# Altium schematic sheet MotorDriver.SchDoc
size A3; SheetNumber: 3; SheetTotal: 4
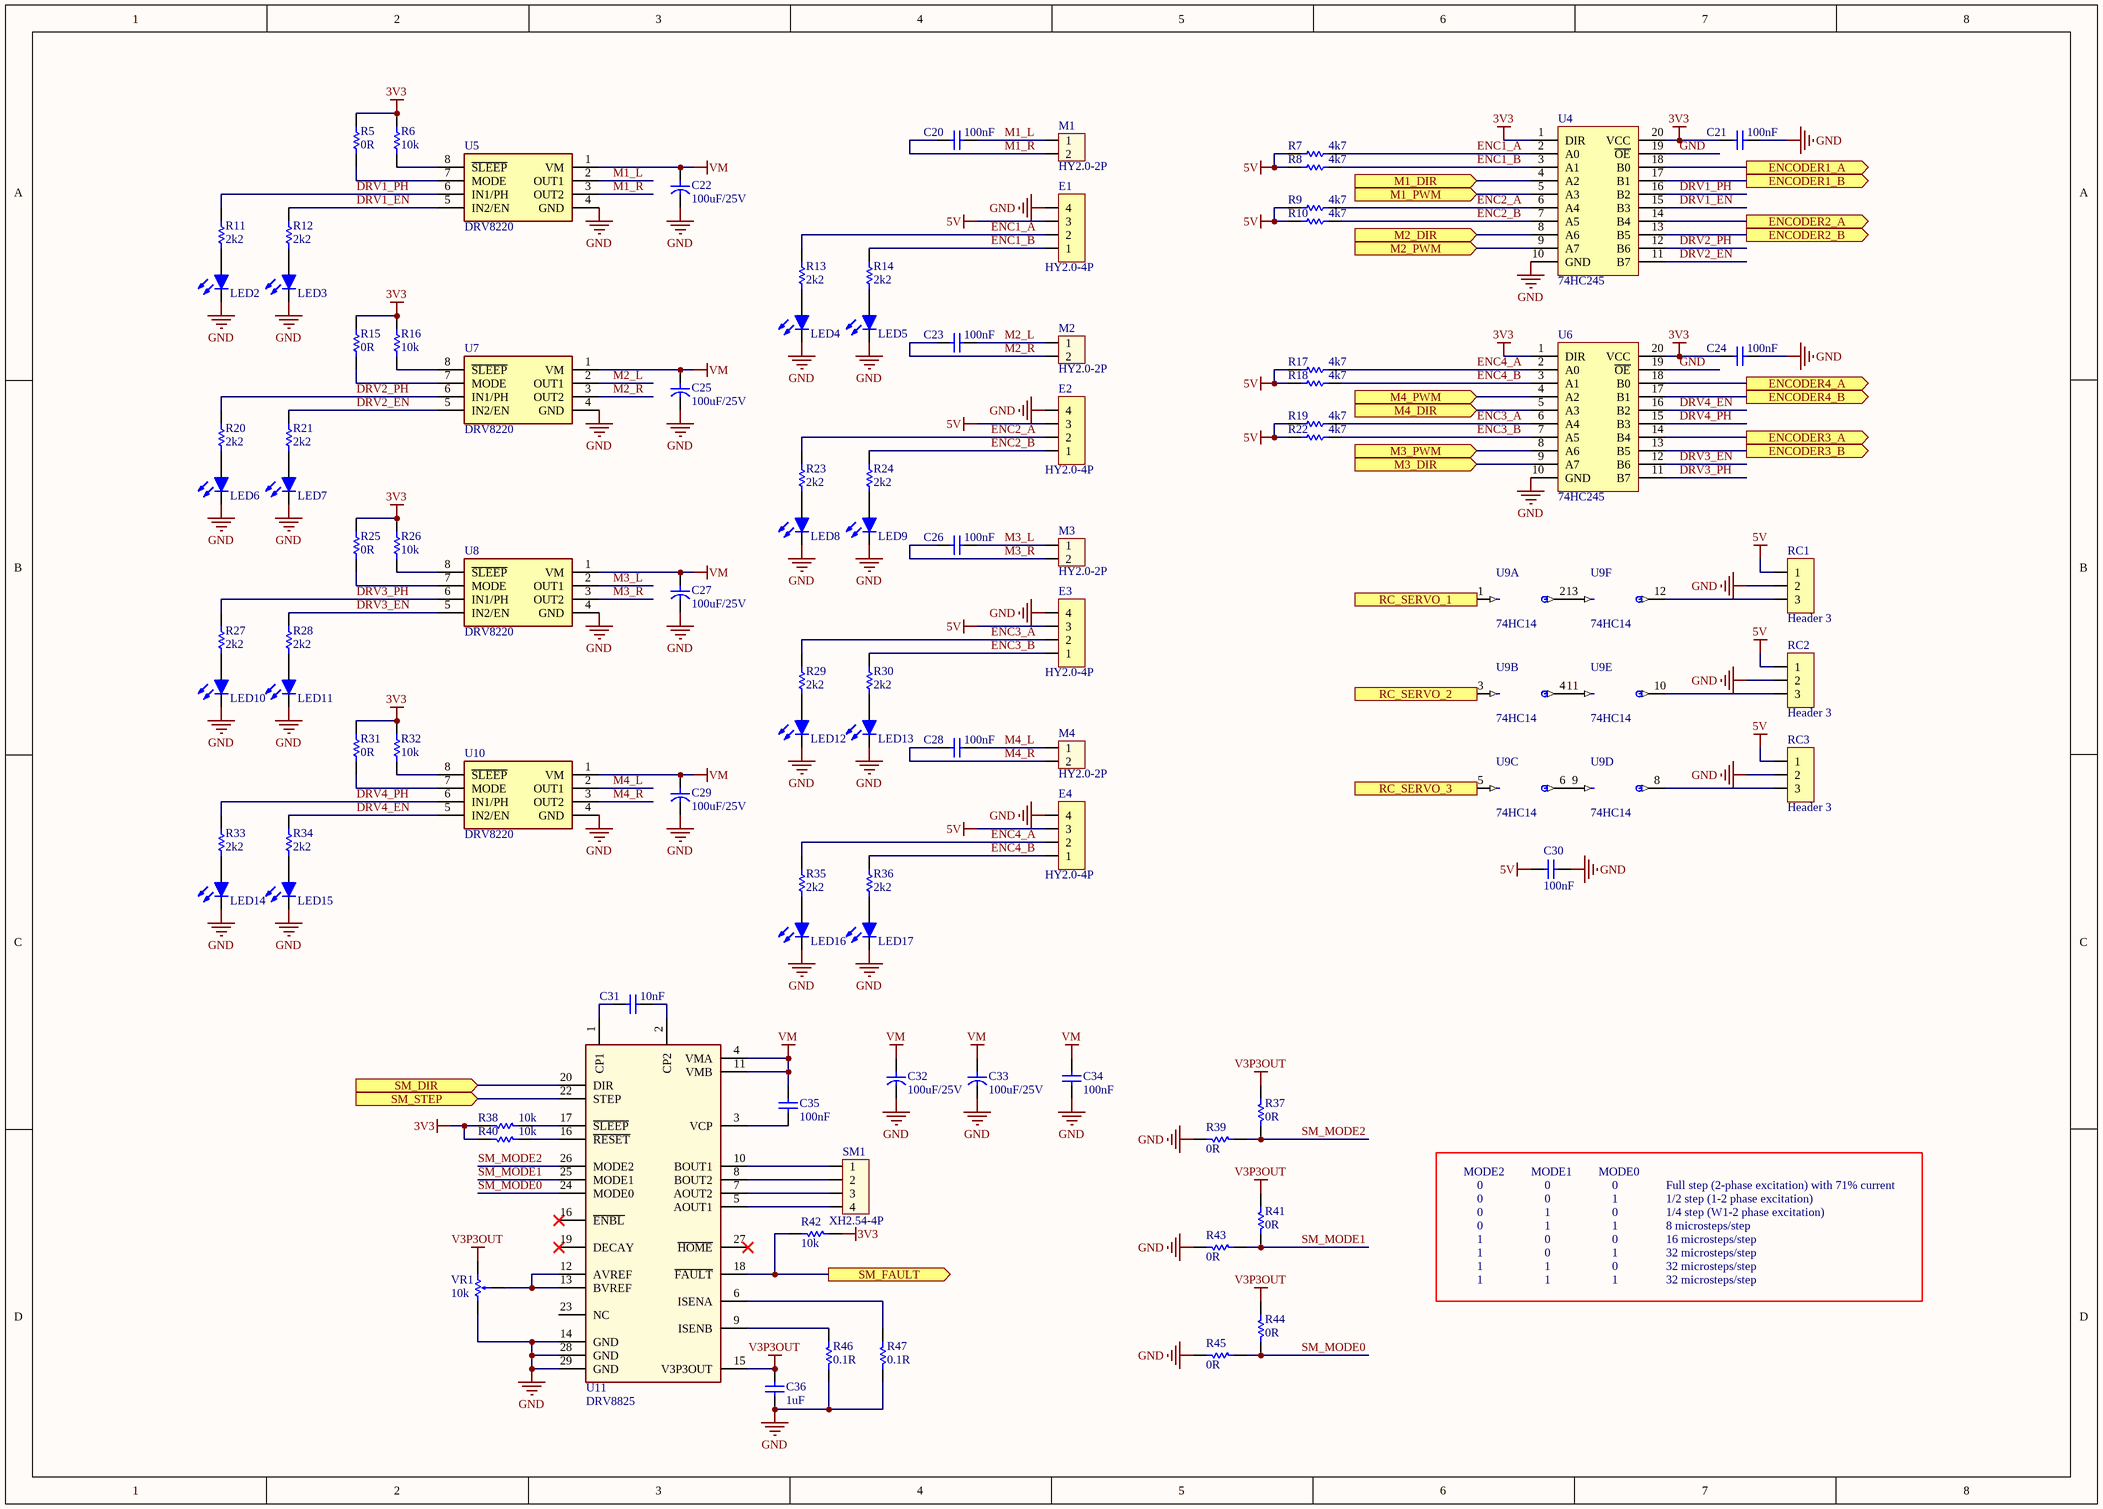
[diagram p0: MotorDriver.SchDoc]

## Parts
C20  100nF  [C 0603 (1608)]
C21  100nF  [C 0603 (1608)]
C22  100uF/25V  [C SMD ALU (D8)]
C23  100nF  [C 0603 (1608)]
C24  100nF  [C 0603 (1608)]
C25  100uF/25V  [C SMD ALU (D8)]
C26  100nF  [C 0603 (1608)]
C27  100uF/25V  [C SMD ALU (D8)]
C28  100nF  [C 0603 (1608)]
C29  100uF/25V  [C SMD ALU (D8)]
C30  100nF  [C 0603 (1608)]
C31  10nF  [C 0603 (1608)]
C32  100uF/25V  [C SMD ALU (D8)]
C33  100uF/25V  [C SMD ALU (D8)]
C34  100nF  [C 0603 (1608)]
C35  100nF  [C 0603 (1608)]
C36  1uF  [C 0603 (1608)]
E1  HY2.0-4P  [HY2.0-4P-RA]
E2  HY2.0-4P  [HY2.0-4P-RA]
E3  HY2.0-4P  [HY2.0-4P-RA]
E4  HY2.0-4P  [HY2.0-4P-RA]
LED2  Led-Red  [Led SMD 0603]  (value not drawn)
LED3  Led-Red  [Led SMD 0603]  (value not drawn)
LED4  Led-Red  [Led SMD 0603]  (value not drawn)
LED5  Led-Red  [Led SMD 0603]  (value not drawn)
LED6  Led-Red  [Led SMD 0603]  (value not drawn)
LED7  Led-Red  [Led SMD 0603]  (value not drawn)
LED8  Led-Red  [Led SMD 0603]  (value not drawn)
LED9  Led-Red  [Led SMD 0603]  (value not drawn)
LED10  Led-Red  [Led SMD 0603]  (value not drawn)
LED11  Led-Red  [Led SMD 0603]  (value not drawn)
LED12  Led-Red  [Led SMD 0603]  (value not drawn)
LED13  Led-Red  [Led SMD 0603]  (value not drawn)
LED14  Led-Red  [Led SMD 0603]  (value not drawn)
LED15  Led-Red  [Led SMD 0603]  (value not drawn)
LED16  Led-Red  [Led SMD 0603]  (value not drawn)
LED17  Led-Red  [Led SMD 0603]  (value not drawn)
M1  HY2.0-2P  [HY2.0-2P-RA]
M2  HY2.0-2P  [HY2.0-2P-RA]
M3  HY2.0-2P  [HY2.0-2P-RA]
M4  HY2.0-2P  [HY2.0-2P-RA]
R5  0R  [R 0603 (1608)]
R6  10k  [R 0603 (1608)]
R7  4k7  [R 0603 (1608)]
R8  4k7  [R 0603 (1608)]
R9  4k7  [R 0603 (1608)]
R10  4k7  [R 0603 (1608)]
R11  2k2  [R 0603 (1608)]
R12  2k2  [R 0603 (1608)]
R13  2k2  [R 0603 (1608)]
R14  2k2  [R 0603 (1608)]
R15  0R  [R 0603 (1608)]
R16  10k  [R 0603 (1608)]
R17  4k7  [R 0603 (1608)]
R18  4k7  [R 0603 (1608)]
R19  4k7  [R 0603 (1608)]
R20  2k2  [R 0603 (1608)]
R21  2k2  [R 0603 (1608)]
R22  4k7  [R 0603 (1608)]
R23  2k2  [R 0603 (1608)]
R24  2k2  [R 0603 (1608)]
R25  0R  [R 0603 (1608)]
R26  10k  [R 0603 (1608)]
R27  2k2  [R 0603 (1608)]
R28  2k2  [R 0603 (1608)]
R29  2k2  [R 0603 (1608)]
R30  2k2  [R 0603 (1608)]
R31  0R  [R 0603 (1608)]
R32  10k  [R 0603 (1608)]
R33  2k2  [R 0603 (1608)]
R34  2k2  [R 0603 (1608)]
R35  2k2  [R 0603 (1608)]
R36  2k2  [R 0603 (1608)]
R37  0R  [R 0603 (1608)]
R38  10k  [R 0603 (1608)]
R39  0R  [R 0603 (1608)]
R40  10k  [R 0603 (1608)]
R41  0R  [R 0603 (1608)]
R42  10k  [R 0603 (1608)]
R43  0R  [R 0603 (1608)]
R44  0R  [R 0603 (1608)]
R45  0R  [R 0603 (1608)]
R46  0.1R  [R 1206 (3216)]
R47  0.1R  [R 1206 (3216)]
RC1  Header 3  [Header 3 - RA]
RC2  Header 3  [Header 3 - RA]
RC3  Header 3  [Header 3 - RA]
SM1  XH2.54-4P  [CON Header 4 - RA]
U4  74HC245  [TSSOP 20 65P]
U5  DRV8220  [WSON 2X2X0.5MM]
U6  74HC245  [TSSOP 20 65P]
U7  DRV8220  [WSON 2X2X0.5MM]
U8  DRV8220  [WSON 2X2X0.5MM]
U9  74HC14  [TSSOP 14 65P]  (parts A,B,C,D,E,F of 6)
U10  DRV8220  [WSON 2X2X0.5MM]
U11  DRV8825  [TSSOP 28 65P EP]
VR1  10k  [TRIM_TC33X-2-103E]

## Ports
ENCODER1_A (out), ENCODER1_B (out), ENCODER2_A (out), ENCODER2_B (out), ENCODER3_A (out), ENCODER3_B (out), ENCODER4_A (out), ENCODER4_B (out), M1_DIR (in), M1_PWM (in), M2_DIR (in), M2_PWM (in), M3_DIR (in), M3_PWM (in), M4_DIR (in), M4_PWM (in), RC_SERVO_1 (in), RC_SERVO_2 (in), RC_SERVO_3 (in), SM_DIR (in), SM_FAULT (out), SM_STEP (in)

## Nets
3V3: C21.1 C24.1 R5.2 R6.2 R15.2 R16.2 R25.2 R26.2 R31.2 R32.2 R38.1 R40.1 R42.2 U4.1(DIR) U4.20(VCC) U6.1(DIR) U6.20(VCC)
5V: C30.1 E1.3 E2.3 E3.3 E4.3 R7.2 R8.2 R9.2 R10.2 R17.2 R18.2 R19.2 R22.2 RC1.1 RC2.1 RC3.1
GND: C21.2 C22.2 C24.2 C25.2 C27.2 C29.2 C30.2 C32.2 C33.2 C34.1 C36.2 E1.4 E2.4 E3.4 E4.4 LED2.2(K) LED3.2(K) LED4.2(K) LED5.2(K) LED6.2(K) LED7.2(K) LED8.2(K) LED9.2(K) LED10.2(K) LED11.2(K) LED12.2(K) LED13.2(K) LED14.2(K) LED15.2(K) LED16.2(K) LED17.2(K) R39.1 R43.1 R45.1 R46.2 R47.2 RC1.2 RC2.2 RC3.2 U4.10(GND) U4.19(~{OE}) U5.4(GND) U6.10(GND) U6.19(~{OE}) U7.4(GND) U8.4(GND) U9.7(GND) U10.4(GND) U11.14(GND) U11.28(GND) U11.29(GND) VR1.3
V3P3OUT: C36.1 R37.1 R41.1 R44.1 U11.15(V3P3OUT) VR1.1
VCC: U9.14(+)
VM: C22.1 C25.1 C27.1 C29.1 C32.1 C33.1 C34.2 C35.1 U5.1(VM) U7.1(VM) U8.1(VM) U10.1(VM) U11.4(VMA) U11.11(VMB)
DRV1_EN: R12.2 U4.15(B3) U5.5(IN2/EN)
DRV1_PH: R11.2 U4.16(B2) U5.6(IN1/PH)
DRV2_EN: R21.2 U4.11(B7) U7.5(IN2/EN)
DRV2_PH: R20.2 U4.12(B6) U7.6(IN1/PH)
DRV3_EN: R28.2 U6.12(B6) U8.5(IN2/EN)
DRV3_PH: R27.2 U6.11(B7) U8.6(IN1/PH)
DRV4_EN: R34.2 U6.16(B2) U10.5(IN2/EN)
DRV4_PH: R33.2 U6.15(B3) U10.6(IN1/PH)
ENC1_A: E1.2 R7.1 R13.2 U4.2(A0)
ENC1_B: E1.1 R8.1 R14.2 U4.3(A1)
ENC2_A: E2.2 R9.1 R23.2 U4.6(A4)
ENC2_B: E2.1 R10.1 R24.2 U4.7(A5)
ENC3_A: E3.2 R19.1 R29.2 U6.6(A4)
ENC3_B: E3.1 R22.1 R30.2 U6.7(A5)
ENC4_A: E4.2 R17.1 R35.2 U6.2(A0)
ENC4_B: E4.1 R18.1 R36.2 U6.3(A1)
ENCODER1_A: U4.18(B0) ; port ENCODER1_A
ENCODER1_B: U4.17(B1) ; port ENCODER1_B
ENCODER2_A: U4.14(B4) ; port ENCODER2_A
ENCODER2_B: U4.13(B5) ; port ENCODER2_B
ENCODER3_A: U6.14(B4) ; port ENCODER3_A
ENCODER3_B: U6.13(B5) ; port ENCODER3_B
ENCODER4_A: U6.18(B0) ; port ENCODER4_A
ENCODER4_B: U6.17(B1) ; port ENCODER4_B
M1_DIR: U4.4(A2) ; port M1_DIR
M1_L: C20.2 M1.1 U5.2(OUT1)
M1_PWM: U4.5(A3) ; port M1_PWM
M1_R: C20.1 M1.2 U5.3(OUT2)
M2_DIR: U4.8(A6) ; port M2_DIR
M2_L: C23.2 M2.1 U7.2(OUT1)
M2_PWM: U4.9(A7) ; port M2_PWM
M2_R: C23.1 M2.2 U7.3(OUT2)
M3_DIR: U6.9(A7) ; port M3_DIR
M3_L: C26.2 M3.1 U8.2(OUT1)
M3_PWM: U6.8(A6) ; port M3_PWM
M3_R: C26.1 M3.2 U8.3(OUT2)
M4_DIR: U6.5(A3) ; port M4_DIR
M4_L: C28.2 M4.1 U10.2(OUT1)
M4_PWM: U6.4(A2) ; port M4_PWM
M4_R: C28.1 M4.2 U10.3(OUT2)
RC_SERVO_1: U9.1(1A) ; port RC_SERVO_1
RC_SERVO_2: U9.3(2A) ; port RC_SERVO_2
RC_SERVO_3: U9.5(3A) ; port RC_SERVO_3
SM_DIR: U11.20(DIR) ; port SM_DIR
SM_FAULT: R42.1 U11.18(~{FAULT}) ; port SM_FAULT
SM_MODE0: R44.2 R45.2 U11.24(MODE0)
SM_MODE1: R41.2 R43.2 U11.25(MODE1)
SM_MODE2: R37.2 R39.2 U11.26(MODE2)
SM_STEP: U11.22(STEP) ; port SM_STEP
NetC31_1: C31.1 U11.2(CP2)
NetC31_2: C31.2 U11.1(CP1)
NetC35_2: C35.2 U11.3(VCP)
NetLED2_1: LED2.1(A) R11.1
NetLED3_1: LED3.1(A) R12.1
NetLED4_1: LED4.1(A) R13.1
NetLED5_1: LED5.1(A) R14.1
NetLED6_1: LED6.1(A) R20.1
NetLED7_1: LED7.1(A) R21.1
NetLED8_1: LED8.1(A) R23.1
NetLED9_1: LED9.1(A) R24.1
NetLED10_1: LED10.1(A) R27.1
NetLED11_1: LED11.1(A) R28.1
NetLED12_1: LED12.1(A) R29.1
NetLED13_1: LED13.1(A) R30.1
NetLED14_1: LED14.1(A) R33.1
NetLED15_1: LED15.1(A) R34.1
NetLED16_1: LED16.1(A) R35.1
NetLED17_1: LED17.1(A) R36.1
NetR5_1: R5.1 U5.7(MODE)
NetR6_1: R6.1 U5.8(~{SLEEP})
NetR15_1: R15.1 U7.7(MODE)
NetR16_1: R16.1 U7.8(~{SLEEP})
NetR25_1: R25.1 U8.7(MODE)
NetR26_1: R26.1 U8.8(~{SLEEP})
NetR31_1: R31.1 U10.7(MODE)
NetR32_1: R32.1 U10.8(~{SLEEP})
NetR38_2: R38.2 U11.17(~{SLEEP})
NetR40_2: R40.2 U11.16(~{RESET})
NetR46_1: R46.1 U11.9(ISENB)
NetR47_1: R47.1 U11.6(ISENA)
NetRC1_3: RC1.3 U9.12(6Y)
NetRC2_3: RC2.3 U9.10(5Y)
NetRC3_3: RC3.3 U9.8(4Y)
NetSM1_1: SM1.1 U11.10(BOUT1)
NetSM1_2: SM1.2 U11.8(BOUT2)
NetSM1_3: SM1.3 U11.7(AOUT2)
NetSM1_4: SM1.4 U11.5(AOUT1)
NetU9_2: U9.2(1Y) U9.13(6A)
NetU9_4: U9.4(2Y) U9.11(5A)
NetU9_6: U9.6(3Y) U9.9(4A)
NetU11_12: U11.12(AVREF) U11.13(BVREF) VR1.2

Not connected (* = marked no-connect by the designer): U11 19(DECAY)* 23(NC) 27(~{HOME})*

## Notes on the sheet
- MODE2
- 0
- MODE1
- MODE0
- Full step (2-phase excitation) with 71% current
- 1
- 1/2 step (1-2 phase excitation)
- 1/4 step (W1-2 phase excitation)
- 8 microsteps/step
- 16 microsteps/step
- 32 microsteps/step

## Library data of the parts
C20 C21 C23 C24 C26 C28 C30 C31 C34-C36 = Capacitor NP: Capacitor non-pol
C22 C25 C27 C29 C32 C33 = Capacitor: Capacitor pol
E1-E4 = Header 4: Header, 4-Pin
LED2-LED17 = Led: Typical LED
M1-M4 = Con2: Connector 2; Value: Connector 2
R5-R47 = Resistor: Published: 8-Jun-2000; LatestRevisionDate: 17-Jul-2002; LatestRevisionNote: Re-released for DXP Platform.; PackageReference: AXIAL-0.3; Publisher: Altium Limited
RC1-RC3 = Header 3: Header, 3-Pin
SM1 = Con4: Connector 4; Value: Connector 4
U4 U6 = 74HC245: Octal bus tranceiver, 3-state
U5 U7 U8 U10 = DRV8220: 18-V H-Bridge Motor Driver; MP: DRV8838DSGR; MF: Texas Instruments; Package: WSON-8 Texas Instruments; SnapEDA_Link: https://www.snapeda.com/parts/DRV8838DSGR/Texas+Instruments/view-part/?ref=snap; Purchase-URL: https://pricing.snapeda.com/search/part/DRV8838DSGR/?ref=eda; Check_prices: https://www.snapeda.com/parts/DRV8838DSGR/Texas+Instruments/view-part/?ref=eda; Availability: In Stock; Value: *; Price: None
U9 = 74HC14: Hex Schmitt Trigger
VR1 = Resistor Variable